# Altium schematic sheet GPIO.SchDoc: APTOMAT - Power Supply
size A4; Revision: 1.1.1; SheetNumber: 5; SheetTotal: 5; DrawnBy: KJP; ProjectNumber: 4397; PCBRevision: 0071KJP; DocumentSize: A4; PCAName: PCA10040; PCBNumber: 400150; ProjectName: Quark
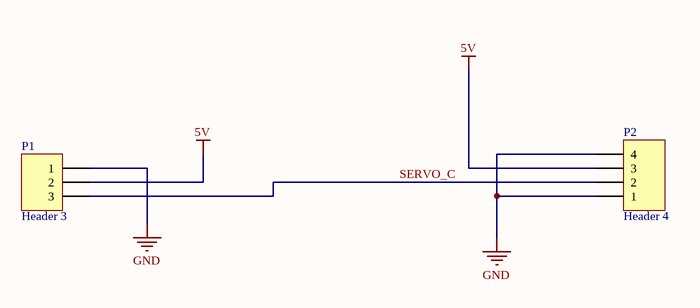
[diagram p0: GPIO.SchDoc]

## Parts
P1  Header 3  [HDR1X3]
P2  Header 4  [CONfLAT]

## Nets
5V: P1.2 P2.3
GND: P1.1 P2.1 P2.4
SERVO_C: P1.3 P2.2

## Library data of the parts
P1 = Header 3: Header, 3-Pin; LatestRevisionDate: 17-Jul-2002; LatestRevisionNote: Re-released for DXP Platform.; Publisher: Altium Limited
P2 = Header 4: Header, 4-Pin; LatestRevisionDate: 17-Jul-2002; LatestRevisionNote: Re-released for DXP Platform.; Publisher: Altium Limited